# EAGLE schematic DUAL_M2_LEDS (EAGLE 9.6.2)
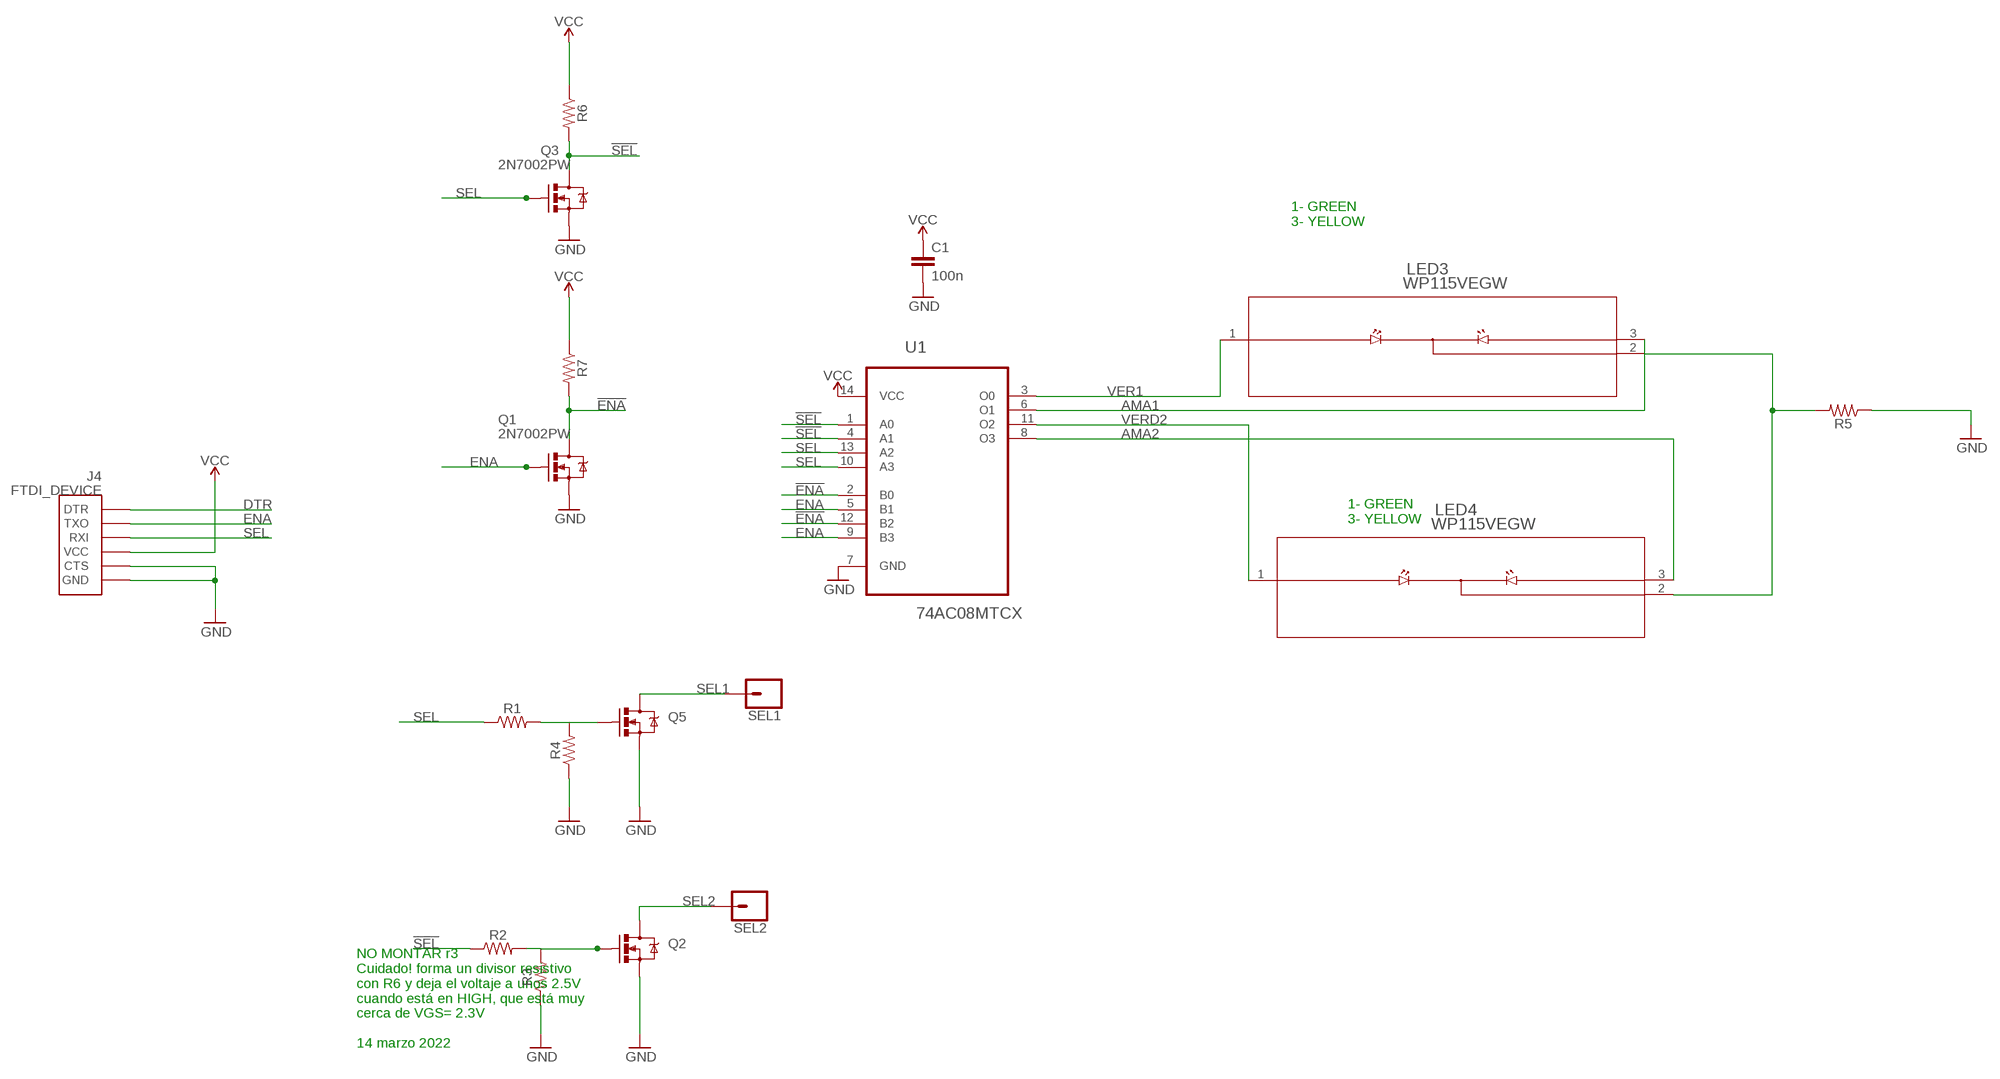
[diagram p0: schematic, sheet 1, part 1 of 2]
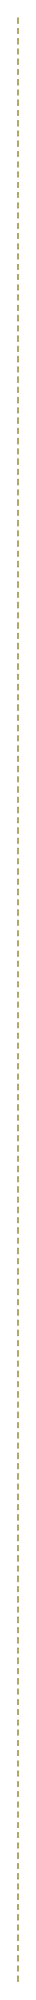
[diagram p1: schematic, sheet 1, part 2 of 2]

## Parts
C1  100n  CAPACITOR-N0805  [0805]
J4  FTDI_DEVICE  [FTDI_DEVICE_SIDE]
LED3  WP115VEGW  [WP115VEGW_KNB]
LED4  WP115VEGW  [WP115VEGW_KNB]
Q1  2N7002PW  MOSFET-NCHANNEL2N7002PW  [SOT323]
Q2  2N7002PW  MOSFET-NCHANNEL2N7002PW  [SOT323]
Q3  2N7002PW  MOSFET-NCHANNEL2N7002PW  [SOT323]
Q5  2N7002PW  MOSFET-NCHANNEL2N7002PW  [SOT323]
R1  RESISTOR0805  [0805]
R2  RESISTOR0805  [0805]
R3  RESISTOR0805  [0805]
R4  RESISTOR0805  [0805]
R5  RESISTOR0805  [0805]
R6  RESISTOR0805  [0805]
R7  RESISTOR0805  [0805]
SEL1  CONN_01  [1X01]
SEL2  CONN_01  [1X01]
U1  74AC08MTCX  [SOP65P640X120-14N]

## Nets
!ENA!: Q1.3(D) R7.2 U1.2(B0) U1.12(B2)
!SEL!: Q3.3(D) R2.1 R6.2 U1.1(A0) U1.4(A1)
AMA1: LED3.3 U1.6(O1)
AMA2: LED4.3 U1.8(O3)
DTR: J4.P$1(DTR)
ENA: J4.P$2(TXO) Q1.1(G) U1.5(B1) U1.9(B3)
GND: C1.2 J4.P$5(CTS) J4.P$6(GND) Q1.2(S) Q2.2(S) Q3.2(S) Q5.2(S) R3.1 R4.1 R5.1 U1.7(GND)
N$1: Q2.1(G) R2.2 R3.2
N$6: Q5.1(G) R1.2 R4.2
N$7: LED3.2 LED4.2 R5.2
SEL: J4.P$3(RXI) Q3.1(G) R1.1 U1.10(A3) U1.13(A2)
SEL1: Q5.3(D) SEL1.1
SEL2: Q2.3(D) SEL2.1
VCC: C1.1 J4.P$4(VCC) R6.1 R7.1 U1.14(VCC)
VER1: LED3.1 U1.3(O0)
VERD2: LED4.1 U1.11(O2)

## Notes on the sheet
- 1- GREEN
  3- YELLOW
- 1- GREEN
  3- YELLOW
- NO MONTAR r3
  Cuidado! forma un divisor resistivo
  con R6 y deja el voltaje a unos 2.5V
  cuando está en HIGH, que está muy
  cerca de VGS= 2.3V
  
  14 marzo 2022

## Library data of the parts
C1 = BeagleBone_Blue_R3:CAPACITOR-N
J4 = SparkFun-Connectors:FTDI_DEVICE: Connector which mates to FTDI basic or FTDI cable.
LED3 LED4 = LED_BICOLOR_3mm:WP115VEGW; BUILT_BY: EMA_Cory; COPYRIGHT: Copyright (C) 2018 Accelerated Designs. All rights reserved; DATASHEET: http://www.kingbrightusa.com/images/catalog/SPEC/WP115VEGW.pdf; MANUFACTURER_PART_NUMBER: WP115VEGW; SOURCELIBRARY: Kingbright_2020-07-02; VENDOR: Kingbright
Q1-Q3 Q5 = SparkFun-DiscreteSemi:MOSFET-NCHANNEL: Common NMOSFET Parts MFG P/N Store ID Prod ID FDD8780 TRANS-09984 SI7820DN TRANS-11055 FDS6630A IC-08089 2N7002PW TRANS-11151 FQP30N06L COM-10213 TRANS-10060 BSS123LT1G TRANS-08345 BSS138 TRANS-00830 BS170 2N7000; PROD_ID: TRANS-11151
R1-R7 = SparkFun-Resistors:RESISTOR: Generic Resistor Package
SEL1 SEL2 = SparkFun-Connectors:CONN_01: Single connection point. Often used as Generic Header-pin footprint for 0.1 inch spaced/style header connections On any of the 0.1 inch spaced packages, you can populate with these: Break Away Headers - Straight <https://www.sparkfun.com/products/116> (PRT-00116) Break Away Male Headers - Right Angle <https://www.sparkfun.com/products/553> (PRT-00553) Female Headers <https://www.sparkfun.com/products/115> (PRT-00115) Break Away Headers - Machine Pin <https://www.sparkfun.com/products/117> (PRT-00117) Break Away Female Headers - Swiss Machine Pin <https://www.sparkfun.com/products/743> (PRT-00743) This device is also useful as a general connection point to wire up your design to another part of your project. Our various solder wires solder well into these plated through hole pads. Hook-Up Wire - Assortment (Stranded, 22 AWG) <https://www.sparkfun.com/products/11375> (PRT-11375) Hook-Up Wire - Assortment (Solid Core, 22 AWG) <https://www.sparkfun.com/products/11367> (PRT-11367) View the entire wire category on our website here <https://www.sparkfun.com/categories/141> Special notes: SMTSO-256-ET is a "flush mount" nut for a 4-40 screw. We mostly use this on specialty testbeds; it is a nice way to connect hardware to your PCB at an adjustable hieght. Also note, the SNAP packages are for using a snappable style connector. We sell a baggie of snaps and they are also used on two LilyPad designs: Snap Assortment - 30 pack (male and female) <https://www.sparkfun.com/products/11347> (DEV-11347) LilyPad Arduino SimpleSnap <https://www.sparkfun.com/products/10941> (DEV-10941) LilyPad SimpleSnap Protoboard <https://www.sparkfun.com/products/10940> (DEV-10940)
U1 = 74AC08MTCX:74AC08MTCX: Quad 2-Input AND Gate; AVAILABILITY: Unavailable; DESCRIPTION: AND Gate IC 4 Channel 14-TSSOP; MF: ON; MP: 74AC08MTCX; PACKAGE: TSSOP WB-14 ON Semiconductor; PRICE: None

## Net classes
1 vcc: width 0.254 mm